# EAGLE board 40x24 (EAGLE 6.2), part 1 of 3
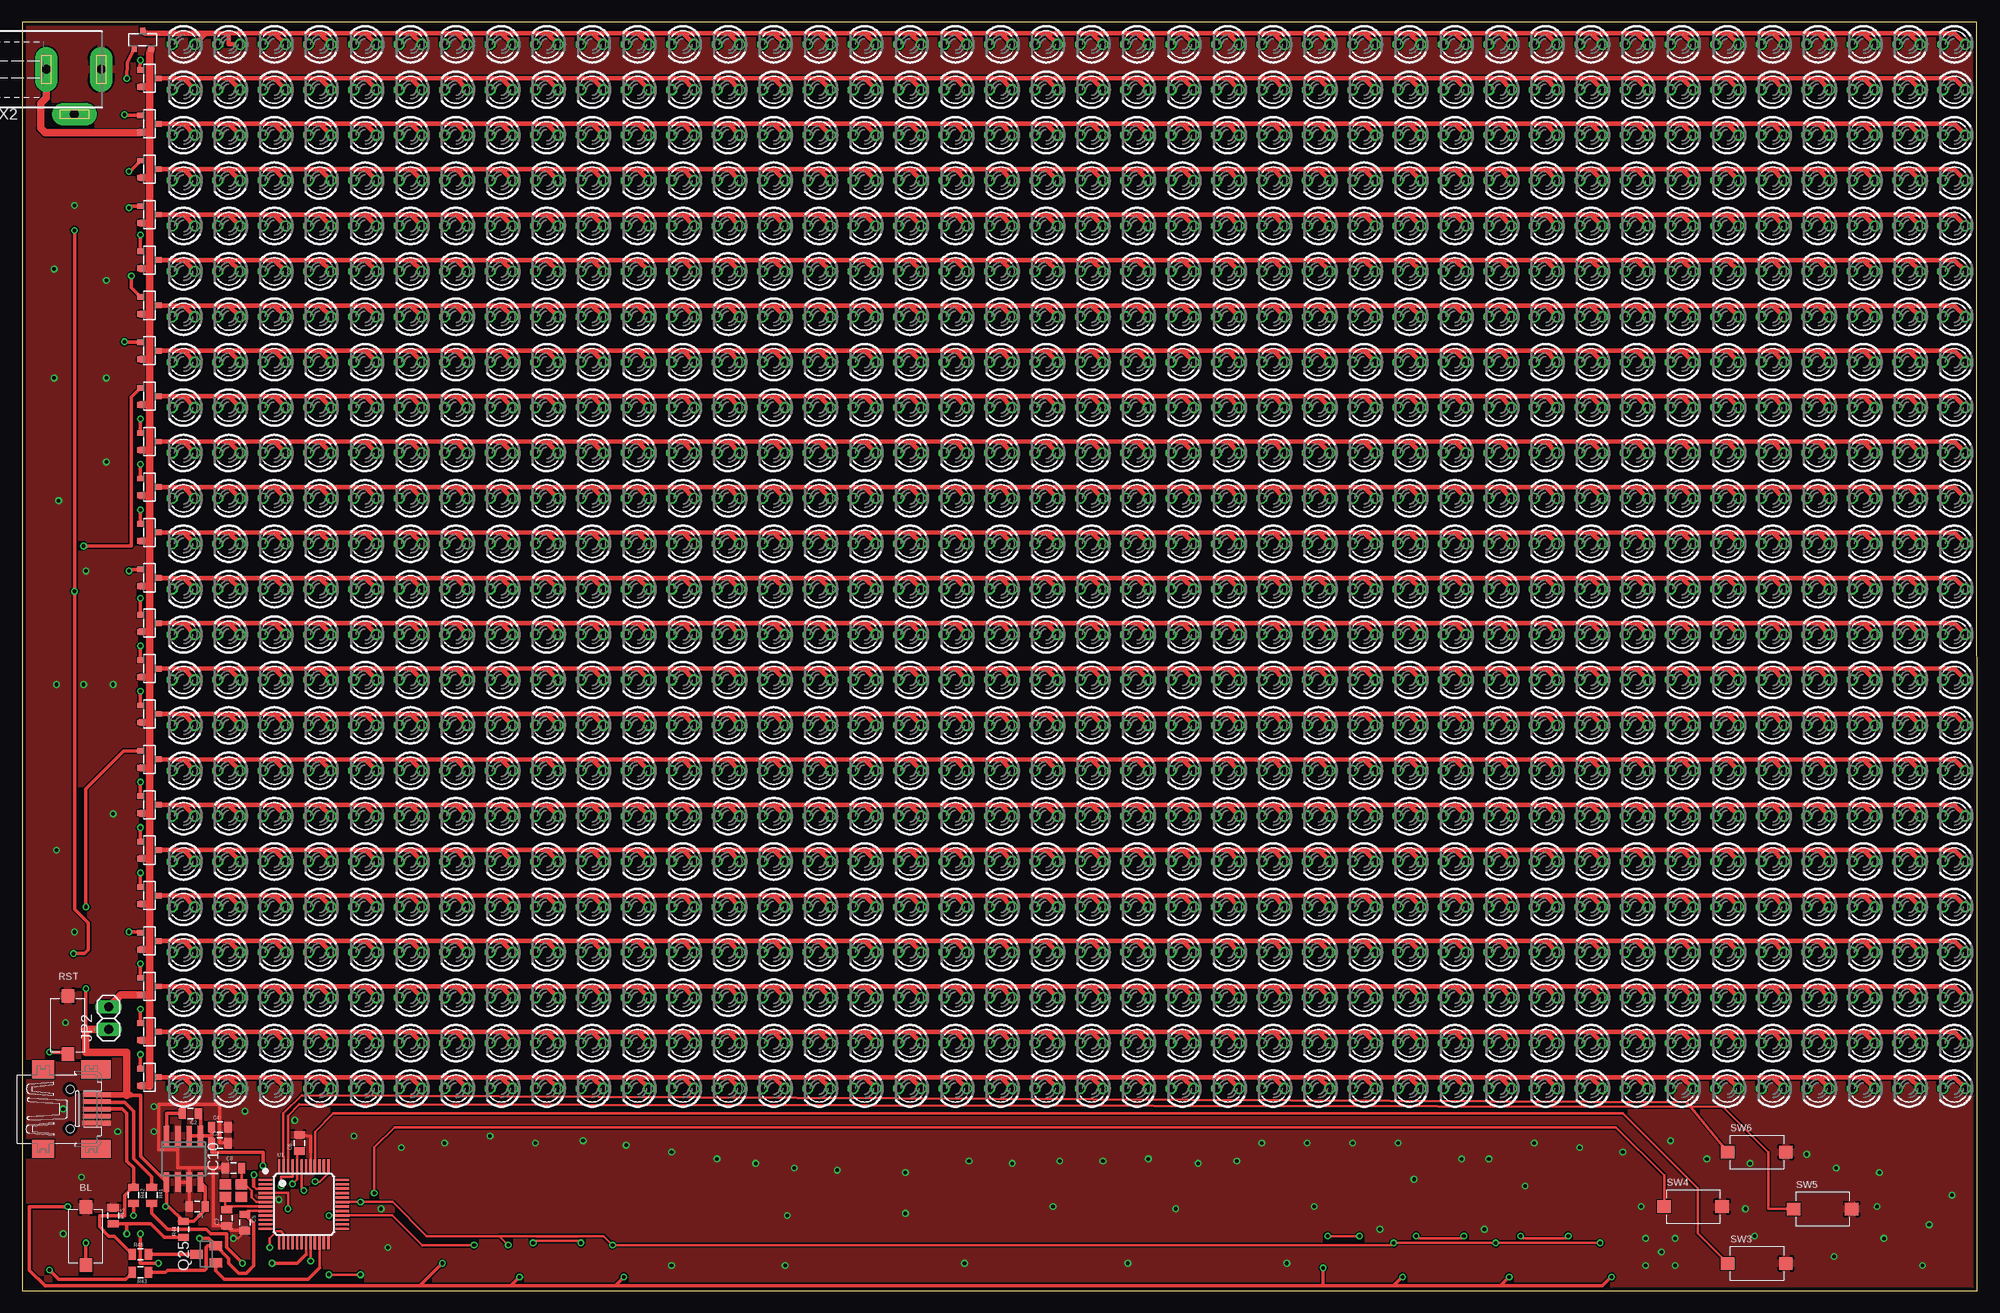
[diagram p4: board, top side]
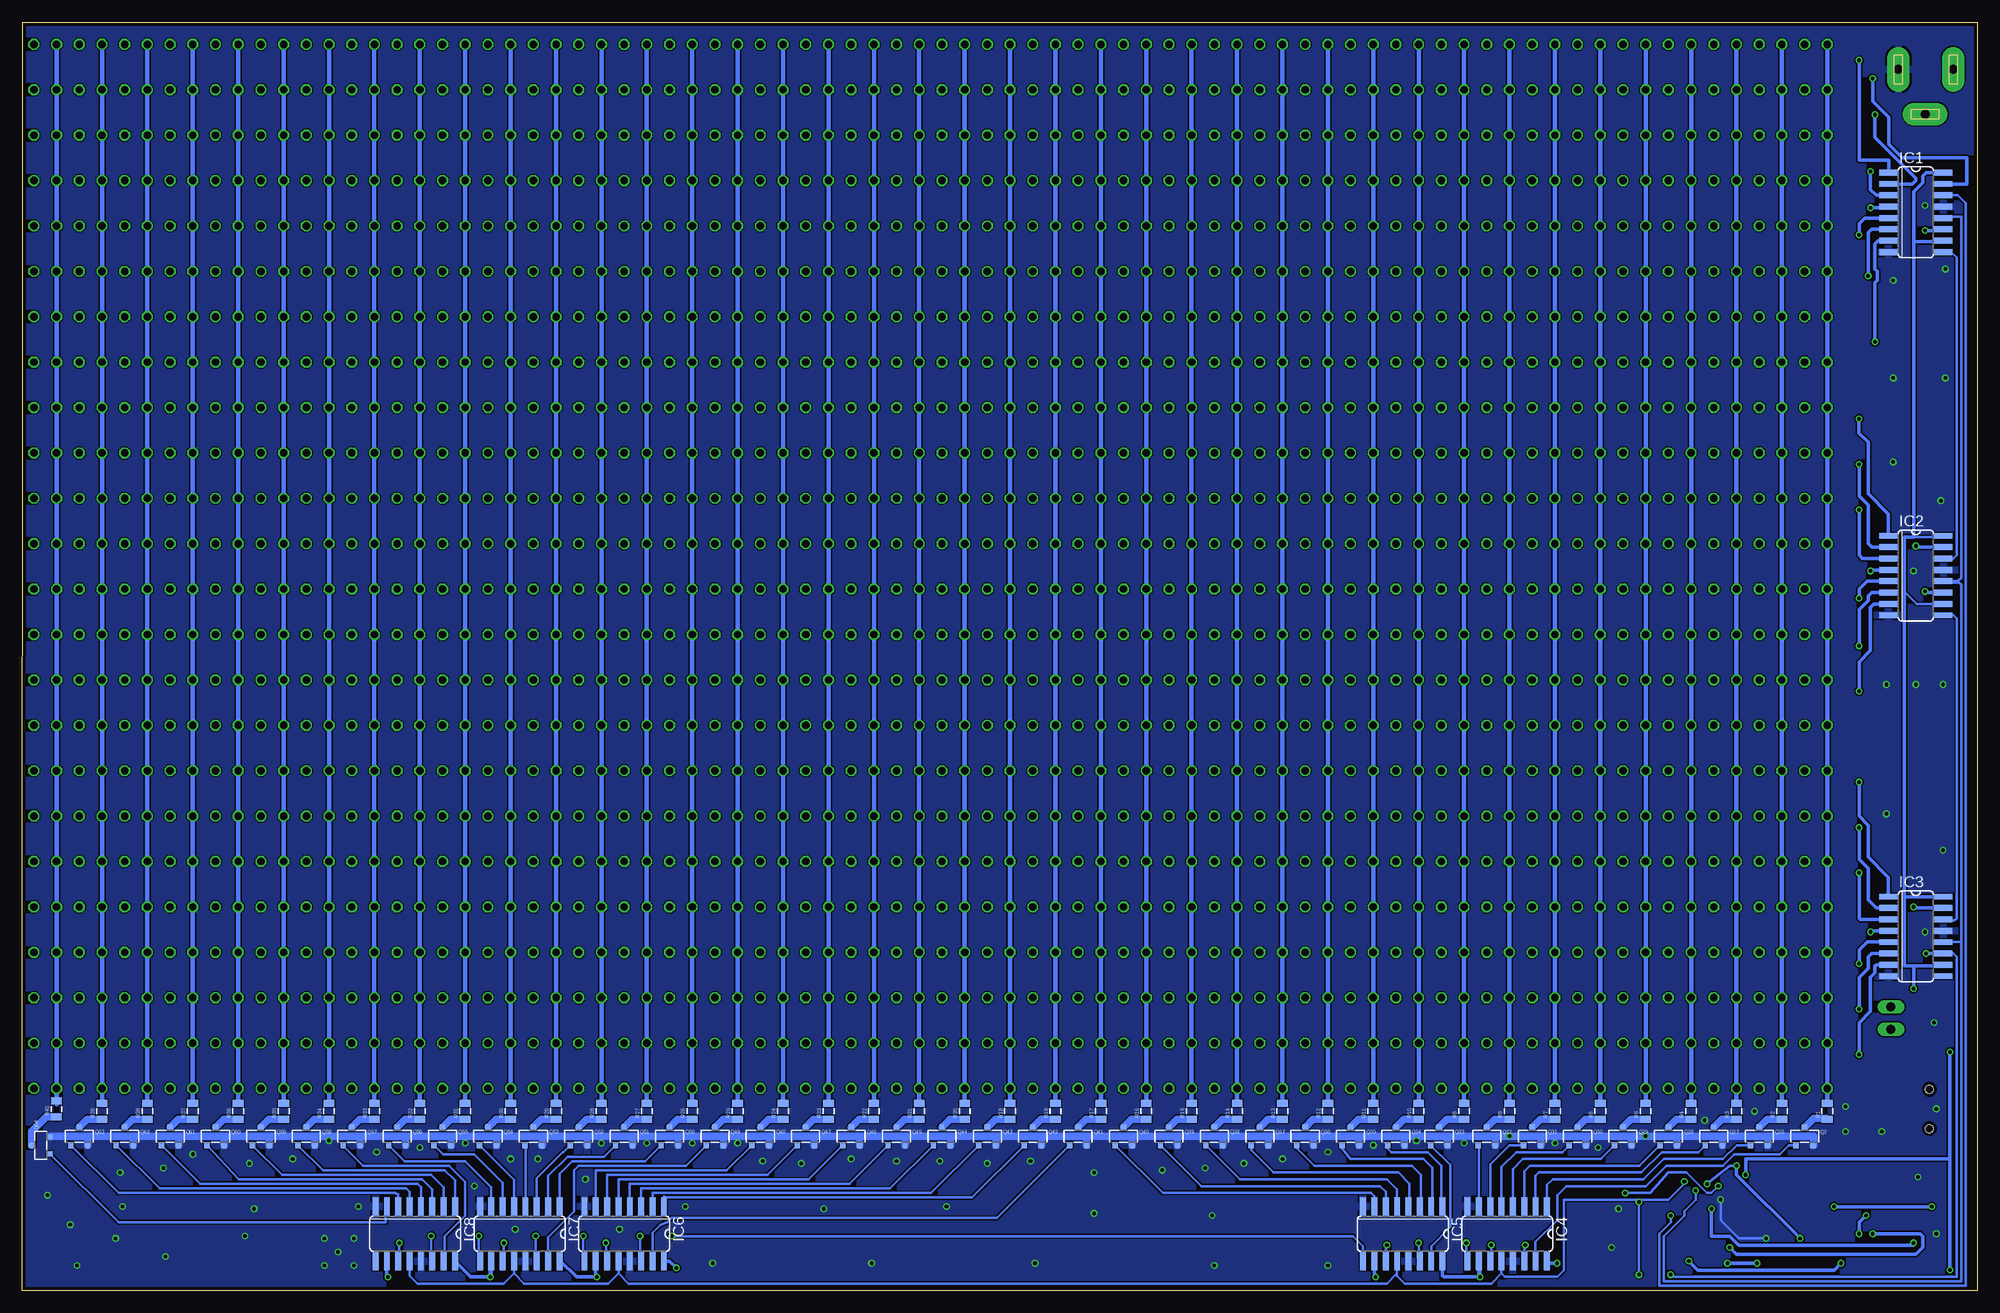
[diagram p5: board, bottom side, seen from below]

Size 218.71 x 141.91 mm. Coordinates in mm from the lower left corner, seen from the top.
Outline: 0,0 218.71,0 218.67,141.91 0,141.91 0,0
Copper layers (1*16): Top 0.0356mm / dielectric 1.5011mm / Bottom 0.0356mm
Design rules: minimum track width 6mil, minimum drill 13mil, track to track 6mil, track to pad 6mil, pad to pad 6mil, via to via 6mil, smd to smd 6mil, copper to edge 15mil, drill to drill 6mil, minimum pad ring 7mil, minimum via ring 7mil, stop-mask expansion 4mil, vias tented up to drill 0mil, thermal gap 10mil

## Footprints (pad centres in the part's own frame; a part is rotated, then mirrored left to right if it is on the bottom)
SWITCH_MCTAEF = smd 1.5 x 1.4: 1 -3.25,0; 2 3.25,0
0805 = smd 0.8 x 1.2: 1 -0.9,0; 2 0.9,0
SO16 = smd 0.66 x 2.032: 1 -4.445,-3.073; 2 -3.175,-3.073; 3 -1.905,-3.073; 4 -0.635,-3.073; 5 0.635,-3.073; 6 1.905,-3.073; 7 3.175,-3.073; 8 4.445,-3.073; 9 4.445,3.073; 10 3.175,3.073; 11 1.905,3.073; 12 0.635,3.073; 13 -0.635,3.073; 14 -1.905,3.073; 15 -3.175,3.073; 16 -4.445,3.073
SOIC8 = smd 0.6 x 2.2: 1 -1.905,-2.6; 2 -0.635,-2.6; 3 0.635,-2.6; 4 1.905,-2.6; 5 1.905,2.6; 6 0.635,2.6; 7 -0.635,2.6; 8 -1.905,2.6
1X02 = drill 1.016 long: 1 -1.27,0; 2 1.27,0
X22 = smd 1.3 x 1.1: 1 0.9,0.7; 2 -0.9,0.7; 3 -0.9,-0.7; 4 0.9,-0.7
LED3MM = drill 0.813 octagon: A -1.27,0; K 1.27,0
SOT23-R = smd 0.6 x 0.7: 1 -0.95,-1; 2 0.95,-1; 3 0,1
SOT23 = smd 1 x 1.4: 1 -0.95,-1.1; 2 0.95,-1.1; 3 0,1.1
LQFP48 = smd 1.5 x 0.25: 1 -4.3,2.75; 2 -4.3,2.25; 3 -4.3,1.75; 4 -4.3,1.25; 5 -4.3,0.75; 6 -4.3,0.25; 7 -4.3,-0.25; 8 -4.3,-0.75; 9 -4.3,-1.25; 10 -4.3,-1.75; 11 -4.3,-2.25; 12 -4.3,-2.75; 25 4.3,-2.75; 26 4.3,-2.25; 27 4.3,-1.75; 28 4.3,-1.25; 29 4.3,-0.75; 30 4.3,-0.25; 31 4.3,0.25; 32 4.3,0.75; 33 4.3,1.25; 34 4.3,1.75; 35 4.3,2.25; 36 4.3,2.75 | smd 0.25 x 1.5: 13 -2.75,-4.3; 14 -2.25,-4.3; 15 -1.75,-4.3; 16 -1.25,-4.3; 17 -0.75,-4.3; 18 -0.25,-4.3; 19 0.25,-4.3; 20 0.75,-4.3; 21 1.25,-4.3; 22 1.75,-4.3; 23 2.25,-4.3; 24 2.75,-4.3; 37 2.75,4.3; 38 2.25,4.3; 39 1.75,4.3; 40 1.25,4.3; 41 0.75,4.3; 42 0.25,4.3; 43 -0.25,4.3; 44 -0.75,4.3; 45 -1.25,4.3; 46 -1.75,4.3; 47 -2.25,4.3; 48 -2.75,4.3
32005-201 = smd 3.1 x 0.5: 1 3,1.6; 2 3,0.8; 3 3,0; 4 3,-0.8; 5 3,-1.6 | smd 2.5 x 2: M1 -3,-4.45; M2 -3,4.45 | smd 3.3 x 2: M3 2.9,4.45; M4 2.9,-4.45 | hole 0.9: 0,2.2; 0,-2.2
733980-62 = drill 1 pad 2.5 long: 1 0,8.57; 2 0,2.42; 3 5,5.57

## Placement (x,y rotation side)
BL  SWITCH_MCTAEF  [SWITCH_MCTAEF]  7.11,6.1 90 top
C1  [0805]  19.56,9.4 180 top
C2  [0805]  18.8,19.81 180 top
C3  [0805]  22.1,16.51 0 top
C4  [0805]  22.1,18.29 0 top
C5  100n  [0805]  24.89,7.62 270 top
C6  100n  [0805]  30.99,16.51 90 top
C7  22pF  [0805]  22.86,8.13 90 top
C8  22pF  [0805]  23.62,13.72 0 top
IC1  74HC595D  [SO16]  6.86,120.65 270 bottom
IC2  74HC595D  [SO16]  6.86,80.01 270 bottom
IC3  74HC595D  [SO16]  6.86,39.62 270 bottom
IC4  74HC595D  [SO16]  52.58,6.35 180 bottom
IC5  74HC595D  [SO16]  64.26,6.35 180 bottom
IC6  74HC595D  [SO16]  151.38,6.35 180 bottom
IC7  74HC595D  [SO16]  163.07,6.35 180 bottom
IC8  74HC595D  [SO16]  174.75,6.35 180 bottom
IC10  LT1763CS8-3.3  [SOIC8]  18.03,14.73 180 top
JP2  [1X02]  9.65,30.48 90 top
L1  12MHz  [X22]  23.62,11.18 0 top
LED1  [LED3MM]  18.03,139.45 180 top
LED2  [LED3MM]  23.11,139.45 180 top
LED3  [LED3MM]  28.19,139.45 180 top
LED4  [LED3MM]  33.27,139.45 180 top
LED5  [LED3MM]  38.35,139.45 180 top
LED6  [LED3MM]  43.43,139.45 180 top
LED7  [LED3MM]  48.51,139.45 180 top
LED8  [LED3MM]  53.59,139.45 180 top
LED9  [LED3MM]  58.67,139.45 180 top
LED10  [LED3MM]  63.75,139.45 180 top
LED11  [LED3MM]  68.83,139.45 180 top
LED12  [LED3MM]  73.91,139.45 180 top
LED13  [LED3MM]  78.99,139.45 180 top
LED14  [LED3MM]  84.07,139.45 180 top
LED15  [LED3MM]  89.15,139.45 180 top
LED16  [LED3MM]  94.23,139.45 180 top
LED17  [LED3MM]  99.31,139.45 180 top
LED18  [LED3MM]  104.39,139.45 180 top
LED19  [LED3MM]  109.47,139.45 180 top
LED20  [LED3MM]  114.55,139.45 180 top
LED21  [LED3MM]  119.63,139.45 180 top
LED22  [LED3MM]  124.71,139.45 180 top
LED23  [LED3MM]  129.79,139.45 180 top
LED24  [LED3MM]  134.87,139.45 180 top
LED25  [LED3MM]  139.95,139.45 180 top
LED26  [LED3MM]  145.03,139.45 180 top
LED27  [LED3MM]  150.11,139.45 180 top
LED28  [LED3MM]  155.19,139.45 180 top
LED29  [LED3MM]  160.27,139.45 180 top
LED30  [LED3MM]  165.35,139.45 180 top
LED31  [LED3MM]  170.43,139.45 180 top
LED32  [LED3MM]  175.51,139.45 180 top
LED33  [LED3MM]  180.59,139.45 180 top
LED34  [LED3MM]  185.67,139.45 180 top
LED35  [LED3MM]  190.75,139.45 180 top
LED36  [LED3MM]  195.83,139.45 180 top
LED37  [LED3MM]  200.91,139.45 180 top
LED38  [LED3MM]  205.99,139.45 180 top
LED39  [LED3MM]  211.07,139.45 180 top
LED40  [LED3MM]  216.15,139.45 180 top
LED41  [LED3MM]  18.03,134.37 180 top
LED42  [LED3MM]  23.11,134.37 180 top
LED43  [LED3MM]  28.19,134.37 180 top
LED44  [LED3MM]  33.27,134.37 180 top
LED45  [LED3MM]  38.35,134.37 180 top
LED46  [LED3MM]  43.43,134.37 180 top
LED47  [LED3MM]  48.51,134.37 180 top
LED48  [LED3MM]  53.59,134.37 180 top
LED49  [LED3MM]  58.67,134.37 180 top
LED50  [LED3MM]  63.75,134.37 180 top
LED51  [LED3MM]  68.83,134.37 180 top
LED52  [LED3MM]  73.91,134.37 180 top
LED53  [LED3MM]  78.99,134.37 180 top
LED54  [LED3MM]  84.07,134.37 180 top
LED55  [LED3MM]  89.15,134.37 180 top
LED56  [LED3MM]  94.23,134.37 180 top
LED57  [LED3MM]  99.31,134.37 180 top
LED58  [LED3MM]  104.39,134.37 180 top
LED59  [LED3MM]  109.47,134.37 180 top
LED60  [LED3MM]  114.55,134.37 180 top
LED61  [LED3MM]  119.63,134.37 180 top
LED62  [LED3MM]  124.71,134.37 180 top
LED63  [LED3MM]  129.79,134.37 180 top
LED64  [LED3MM]  134.87,134.37 180 top
LED65  [LED3MM]  139.95,134.37 180 top
LED66  [LED3MM]  145.03,134.37 180 top
LED67  [LED3MM]  150.11,134.37 180 top
LED68  [LED3MM]  155.19,134.37 180 top
LED69  [LED3MM]  160.27,134.37 180 top
LED70  [LED3MM]  165.35,134.37 180 top
LED71  [LED3MM]  170.43,134.37 180 top
LED72  [LED3MM]  175.51,134.37 180 top
LED73  [LED3MM]  180.59,134.37 180 top
LED74  [LED3MM]  185.67,134.37 180 top
LED75  [LED3MM]  190.75,134.37 180 top
LED76  [LED3MM]  195.83,134.37 180 top
LED77  [LED3MM]  200.91,134.37 180 top
LED78  [LED3MM]  205.99,134.37 180 top
LED79  [LED3MM]  211.07,134.37 180 top
LED80  [LED3MM]  216.15,134.37 180 top
LED81  [LED3MM]  18.03,129.29 180 top
LED82  [LED3MM]  23.11,129.29 180 top
LED83  [LED3MM]  28.19,129.29 180 top
LED84  [LED3MM]  33.27,129.29 180 top
LED85  [LED3MM]  38.35,129.29 180 top
LED86  [LED3MM]  43.43,129.29 180 top
LED87  [LED3MM]  48.51,129.29 180 top
LED88  [LED3MM]  53.59,129.29 180 top
LED89  [LED3MM]  58.67,129.29 180 top
LED90  [LED3MM]  63.75,129.29 180 top
LED91  [LED3MM]  68.83,129.29 180 top
LED92  [LED3MM]  73.91,129.29 180 top
LED93  [LED3MM]  78.99,129.29 180 top
LED94  [LED3MM]  84.07,129.29 180 top
LED95  [LED3MM]  89.15,129.29 180 top
LED96  [LED3MM]  94.23,129.29 180 top
LED97  [LED3MM]  99.31,129.29 180 top
LED98  [LED3MM]  104.39,129.29 180 top
LED99  [LED3MM]  109.47,129.29 180 top
LED100  [LED3MM]  114.55,129.29 180 top
LED101  [LED3MM]  119.63,129.29 180 top
LED102  [LED3MM]  124.71,129.29 180 top
LED103  [LED3MM]  129.79,129.29 180 top
LED104  [LED3MM]  134.87,129.29 180 top
LED105  [LED3MM]  139.95,129.29 180 top
LED106  [LED3MM]  145.03,129.29 180 top
LED107  [LED3MM]  150.11,129.29 180 top
LED108  [LED3MM]  155.19,129.29 180 top
LED109  [LED3MM]  160.27,129.29 180 top
LED110  [LED3MM]  165.35,129.29 180 top
LED111  [LED3MM]  170.43,129.29 180 top
LED112  [LED3MM]  175.51,129.29 180 top
LED113  [LED3MM]  180.59,129.29 180 top
LED114  [LED3MM]  185.67,129.29 180 top
LED115  [LED3MM]  190.75,129.29 180 top
LED116  [LED3MM]  195.83,129.29 180 top
LED117  [LED3MM]  200.91,129.29 180 top
LED118  [LED3MM]  205.99,129.29 180 top
LED119  [LED3MM]  211.07,129.29 180 top
LED120  [LED3MM]  216.15,129.29 180 top
LED121  [LED3MM]  18.03,124.21 180 top
LED122  [LED3MM]  23.11,124.21 180 top
LED123  [LED3MM]  28.19,124.21 180 top
LED124  [LED3MM]  33.27,124.21 180 top
LED125  [LED3MM]  38.35,124.21 180 top
LED126  [LED3MM]  43.43,124.21 180 top
LED127  [LED3MM]  48.51,124.21 180 top
LED128  [LED3MM]  53.59,124.21 180 top
LED129  [LED3MM]  58.67,124.21 180 top
LED130  [LED3MM]  63.75,124.21 180 top
LED131  [LED3MM]  68.83,124.21 180 top
LED132  [LED3MM]  73.91,124.21 180 top
LED133  [LED3MM]  78.99,124.21 180 top
LED134  [LED3MM]  84.07,124.21 180 top
LED135  [LED3MM]  89.15,124.21 180 top
LED136  [LED3MM]  94.23,124.21 180 top
LED137  [LED3MM]  99.31,124.21 180 top
LED138  [LED3MM]  104.39,124.21 180 top
LED139  [LED3MM]  109.47,124.21 180 top
LED140  [LED3MM]  114.55,124.21 180 top
LED141  [LED3MM]  119.63,124.21 180 top
LED142  [LED3MM]  124.71,124.21 180 top
LED143  [LED3MM]  129.79,124.21 180 top
LED144  [LED3MM]  134.87,124.21 180 top
LED145  [LED3MM]  139.95,124.21 180 top
LED146  [LED3MM]  145.03,124.21 180 top
LED147  [LED3MM]  150.11,124.21 180 top
LED148  [LED3MM]  155.19,124.21 180 top
LED149  [LED3MM]  160.27,124.21 180 top
LED150  [LED3MM]  165.35,124.21 180 top
LED151  [LED3MM]  170.43,124.21 180 top
LED152  [LED3MM]  175.51,124.21 180 top
LED153  [LED3MM]  180.59,124.21 180 top
LED154  [LED3MM]  185.67,124.21 180 top
LED155  [LED3MM]  190.75,124.21 180 top
LED156  [LED3MM]  195.83,124.21 180 top
LED157  [LED3MM]  200.91,124.21 180 top
LED158  [LED3MM]  205.99,124.21 180 top
LED159  [LED3MM]  211.07,124.21 180 top
LED160  [LED3MM]  216.15,124.21 180 top
LED161  [LED3MM]  18.03,119.13 180 top
LED162  [LED3MM]  23.11,119.13 180 top
LED163  [LED3MM]  28.19,119.13 180 top
LED164  [LED3MM]  33.27,119.13 180 top
LED165  [LED3MM]  38.35,119.13 180 top
LED166  [LED3MM]  43.43,119.13 180 top
LED167  [LED3MM]  48.51,119.13 180 top
LED168  [LED3MM]  53.59,119.13 180 top
LED169  [LED3MM]  58.67,119.13 180 top
LED170  [LED3MM]  63.75,119.13 180 top
LED171  [LED3MM]  68.83,119.13 180 top
LED172  [LED3MM]  73.91,119.13 180 top
LED173  [LED3MM]  78.99,119.13 180 top
LED174  [LED3MM]  84.07,119.13 180 top
LED175  [LED3MM]  89.15,119.13 180 top
LED176  [LED3MM]  94.23,119.13 180 top
LED177  [LED3MM]  99.31,119.13 180 top
LED178  [LED3MM]  104.39,119.13 180 top
LED179  [LED3MM]  109.47,119.13 180 top
LED180  [LED3MM]  114.55,119.13 180 top
LED181  [LED3MM]  119.63,119.13 180 top
LED182  [LED3MM]  124.71,119.13 180 top
LED183  [LED3MM]  129.79,119.13 180 top
LED184  [LED3MM]  134.87,119.13 180 top
LED185  [LED3MM]  139.95,119.13 180 top
LED186  [LED3MM]  145.03,119.13 180 top
LED187  [LED3MM]  150.11,119.13 180 top
LED188  [LED3MM]  155.19,119.13 180 top
LED189  [LED3MM]  160.27,119.13 180 top
LED190  [LED3MM]  165.35,119.13 180 top
LED191  [LED3MM]  170.43,119.13 180 top
LED192  [LED3MM]  175.51,119.13 180 top
LED193  [LED3MM]  180.59,119.13 180 top
LED194  [LED3MM]  185.67,119.13 180 top
LED195  [LED3MM]  190.75,119.13 180 top
LED196  [LED3MM]  195.83,119.13 180 top
LED197  [LED3MM]  200.91,119.13 180 top
LED198  [LED3MM]  205.99,119.13 180 top
LED199  [LED3MM]  211.07,119.13 180 top
LED200  [LED3MM]  216.15,119.13 180 top
LED201  [LED3MM]  18.03,114.05 180 top
LED202  [LED3MM]  23.11,114.05 180 top
LED203  [LED3MM]  28.19,114.05 180 top
LED204  [LED3MM]  33.27,114.05 180 top
LED205  [LED3MM]  38.35,114.05 180 top
LED206  [LED3MM]  43.43,114.05 180 top
LED207  [LED3MM]  48.51,114.05 180 top
LED208  [LED3MM]  53.59,114.05 180 top
LED209  [LED3MM]  58.67,114.05 180 top
LED210  [LED3MM]  63.75,114.05 180 top
LED211  [LED3MM]  68.83,114.05 180 top
LED212  [LED3MM]  73.91,114.05 180 top
LED213  [LED3MM]  78.99,114.05 180 top
LED214  [LED3MM]  84.07,114.05 180 top
LED215  [LED3MM]  89.15,114.05 180 top
LED216  [LED3MM]  94.23,114.05 180 top
LED217  [LED3MM]  99.31,114.05 180 top
LED218  [LED3MM]  104.39,114.05 180 top
LED219  [LED3MM]  109.47,114.05 180 top
LED220  [LED3MM]  114.55,114.05 180 top
LED221  [LED3MM]  119.63,114.05 180 top
LED222  [LED3MM]  124.71,114.05 180 top
LED223  [LED3MM]  129.79,114.05 180 top
LED224  [LED3MM]  134.87,114.05 180 top
LED225  [LED3MM]  139.95,114.05 180 top
LED226  [LED3MM]  145.03,114.05 180 top
LED227  [LED3MM]  150.11,114.05 180 top
LED228  [LED3MM]  155.19,114.05 180 top
LED229  [LED3MM]  160.27,114.05 180 top
LED230  [LED3MM]  165.35,114.05 180 top
LED231  [LED3MM]  170.43,114.05 180 top
LED232  [LED3MM]  175.51,114.05 180 top
LED233  [LED3MM]  180.59,114.05 180 top
LED234  [LED3MM]  185.67,114.05 180 top
LED235  [LED3MM]  190.75,114.05 180 top
LED236  [LED3MM]  195.83,114.05 180 top
LED237  [LED3MM]  200.91,114.05 180 top
LED238  [LED3MM]  205.99,114.05 180 top
LED239  [LED3MM]  211.07,114.05 180 top
LED240  [LED3MM]  216.15,114.05 180 top
LED241  [LED3MM]  18.03,108.97 180 top
LED242  [LED3MM]  23.11,108.97 180 top
LED243  [LED3MM]  28.19,108.97 180 top
LED244  [LED3MM]  33.27,108.97 180 top
LED245  [LED3MM]  38.35,108.97 180 top
LED246  [LED3MM]  43.43,108.97 180 top
LED247  [LED3MM]  48.51,108.97 180 top
LED248  [LED3MM]  53.59,108.97 180 top
LED249  [LED3MM]  58.67,108.97 180 top
LED250  [LED3MM]  63.75,108.97 180 top
LED251  [LED3MM]  68.83,108.97 180 top
LED252  [LED3MM]  73.91,108.97 180 top
LED253  [LED3MM]  78.99,108.97 180 top
LED254  [LED3MM]  84.07,108.97 180 top
LED255  [LED3MM]  89.15,108.97 180 top
LED256  [LED3MM]  94.23,108.97 180 top
LED257  [LED3MM]  99.31,108.97 180 top
LED258  [LED3MM]  104.39,108.97 180 top
LED259  [LED3MM]  109.47,108.97 180 top
LED260  [LED3MM]  114.55,108.97 180 top
LED261  [LED3MM]  119.63,108.97 180 top
LED262  [LED3MM]  124.71,108.97 180 top
LED263  [LED3MM]  129.79,108.97 180 top
LED264  [LED3MM]  134.87,108.97 180 top
LED265  [LED3MM]  139.95,108.97 180 top
LED266  [LED3MM]  145.03,108.97 180 top
LED267  [LED3MM]  150.11,108.97 180 top
LED268  [LED3MM]  155.19,108.97 180 top
LED269  [LED3MM]  160.27,108.97 180 top
LED270  [LED3MM]  165.35,108.97 180 top
LED271  [LED3MM]  170.43,108.97 180 top
LED272  [LED3MM]  175.51,108.97 180 top
LED273  [LED3MM]  180.59,108.97 180 top
LED274  [LED3MM]  185.67,108.97 180 top
LED275  [LED3MM]  190.75,108.97 180 top
LED276  [LED3MM]  195.83,108.97 180 top
LED277  [LED3MM]  200.91,108.97 180 top
LED278  [LED3MM]  205.99,108.97 180 top
LED279  [LED3MM]  211.07,108.97 180 top
LED280  [LED3MM]  216.15,108.97 180 top
LED281  [LED3MM]  18.03,103.89 180 top
LED282  [LED3MM]  23.11,103.89 180 top
LED283  [LED3MM]  28.19,103.89 180 top
LED284  [LED3MM]  33.27,103.89 180 top
LED285  [LED3MM]  38.35,103.89 180 top
LED286  [LED3MM]  43.43,103.89 180 top
LED287  [LED3MM]  48.51,103.89 180 top
LED288  [LED3MM]  53.59,103.89 180 top
LED289  [LED3MM]  58.67,103.89 180 top
LED290  [LED3MM]  63.75,103.89 180 top
LED291  [LED3MM]  68.83,103.89 180 top
LED292  [LED3MM]  73.91,103.89 180 top
LED293  [LED3MM]  78.99,103.89 180 top
LED294  [LED3MM]  84.07,103.89 180 top
LED295  [LED3MM]  89.15,103.89 180 top
LED296  [LED3MM]  94.23,103.89 180 top
LED297  [LED3MM]  99.31,103.89 180 top
LED298  [LED3MM]  104.39,103.89 180 top
LED299  [LED3MM]  109.47,103.89 180 top
LED300  [LED3MM]  114.55,103.89 180 top
LED301  [LED3MM]  119.63,103.89 180 top
LED302  [LED3MM]  124.71,103.89 180 top
LED303  [LED3MM]  129.79,103.89 180 top
LED304  [LED3MM]  134.87,103.89 180 top
LED305  [LED3MM]  139.95,103.89 180 top
LED306  [LED3MM]  145.03,103.89 180 top
LED307  [LED3MM]  150.11,103.89 180 top
LED308  [LED3MM]  155.19,103.89 180 top
LED309  [LED3MM]  160.27,103.89 180 top
LED310  [LED3MM]  165.35,103.89 180 top
LED311  [LED3MM]  170.43,103.89 180 top
LED312  [LED3MM]  175.51,103.89 180 top
LED313  [LED3MM]  180.59,103.89 180 top
LED314  [LED3MM]  185.67,103.89 180 top
LED315  [LED3MM]  190.75,103.89 180 top
LED316  [LED3MM]  195.83,103.89 180 top
LED317  [LED3MM]  200.91,103.89 180 top
LED318  [LED3MM]  205.99,103.89 180 top
LED319  [LED3MM]  211.07,103.89 180 top
LED320  [LED3MM]  216.15,103.89 180 top
LED321  [LED3MM]  18.03,98.81 180 top
LED322  [LED3MM]  23.11,98.81 180 top
LED323  [LED3MM]  28.19,98.81 180 top
LED324  [LED3MM]  33.27,98.81 180 top
LED325  [LED3MM]  38.35,98.81 180 top
LED326  [LED3MM]  43.43,98.81 180 top
LED327  [LED3MM]  48.51,98.81 180 top
LED328  [LED3MM]  53.59,98.81 180 top
LED329  [LED3MM]  58.67,98.81 180 top
LED330  [LED3MM]  63.75,98.81 180 top
LED331  [LED3MM]  68.83,98.81 180 top
LED332  [LED3MM]  73.91,98.81 180 top
LED333  [LED3MM]  78.99,98.81 180 top
LED334  [LED3MM]  84.07,98.81 180 top
LED335  [LED3MM]  89.15,98.81 180 top
LED336  [LED3MM]  94.23,98.81 180 top
LED337  [LED3MM]  99.31,98.81 180 top
LED338  [LED3MM]  104.39,98.81 180 top
LED339  [LED3MM]  109.47,98.81 180 top
LED340  [LED3MM]  114.55,98.81 180 top
LED341  [LED3MM]  119.63,98.81 180 top
LED342  [LED3MM]  124.71,98.81 180 top
LED343  [LED3MM]  129.79,98.81 180 top
LED344  [LED3MM]  134.87,98.81 180 top
LED345  [LED3MM]  139.95,98.81 180 top
LED346  [LED3MM]  145.03,98.81 180 top
LED347  [LED3MM]  150.11,98.81 180 top
LED348  [LED3MM]  155.19,98.81 180 top
LED349  [LED3MM]  160.27,98.81 180 top
LED350  [LED3MM]  165.35,98.81 180 top
LED351  [LED3MM]  170.43,98.81 180 top
LED352  [LED3MM]  175.51,98.81 180 top
LED353  [LED3MM]  180.59,98.81 180 top
LED354  [LED3MM]  185.67,98.81 180 top
LED355  [LED3MM]  190.75,98.81 180 top
LED356  [LED3MM]  195.83,98.81 180 top
LED357  [LED3MM]  200.91,98.81 180 top
LED358  [LED3MM]  205.99,98.81 180 top
LED359  [LED3MM]  211.07,98.81 180 top
LED360  [LED3MM]  216.15,98.81 180 top
LED361  [LED3MM]  18.03,93.73 180 top
LED362  [LED3MM]  23.11,93.73 180 top
LED363  [LED3MM]  28.19,93.73 180 top
LED364  [LED3MM]  33.27,93.73 180 top
LED365  [LED3MM]  38.35,93.73 180 top
LED366  [LED3MM]  43.43,93.73 180 top
LED367  [LED3MM]  48.51,93.73 180 top
LED368  [LED3MM]  53.59,93.73 180 top
LED369  [LED3MM]  58.67,93.73 180 top
LED370  [LED3MM]  63.75,93.73 180 top
LED371  [LED3MM]  68.83,93.73 180 top
LED372  [LED3MM]  73.91,93.73 180 top
LED373  [LED3MM]  78.99,93.73 180 top
LED374  [LED3MM]  84.07,93.73 180 top
LED375  [LED3MM]  89.15,93.73 180 top
LED376  [LED3MM]  94.23,93.73 180 top
LED377  [LED3MM]  99.31,93.73 180 top
LED378  [LED3MM]  104.39,93.73 180 top
LED379  [LED3MM]  109.47,93.73 180 top
LED380  [LED3MM]  114.55,93.73 180 top
LED381  [LED3MM]  119.63,93.73 180 top
LED382  [LED3MM]  124.71,93.73 180 top
LED383  [LED3MM]  129.79,93.73 180 top
LED384  [LED3MM]  134.87,93.73 180 top
LED385  [LED3MM]  139.95,93.73 180 top
LED386  [LED3MM]  145.03,93.73 180 top
LED387  [LED3MM]  150.11,93.73 180 top
LED388  [LED3MM]  155.19,93.73 180 top
LED389  [LED3MM]  160.27,93.73 180 top
LED390  [LED3MM]  165.35,93.73 180 top
LED391  [LED3MM]  170.43,93.73 180 top
LED392  [LED3MM]  175.51,93.73 180 top
LED393  [LED3MM]  180.59,93.73 180 top
LED394  [LED3MM]  185.67,93.73 180 top
LED395  [LED3MM]  190.75,93.73 180 top
LED396  [LED3MM]  195.83,93.73 180 top
LED397  [LED3MM]  200.91,93.73 180 top
LED398  [LED3MM]  205.99,93.73 180 top
LED399  [LED3MM]  211.07,93.73 180 top
LED400  [LED3MM]  216.15,93.73 180 top
LED401  [LED3MM]  18.03,88.65 180 top
LED402  [LED3MM]  23.11,88.65 180 top
LED403  [LED3MM]  28.19,88.65 180 top
LED404  [LED3MM]  33.27,88.65 180 top
LED405  [LED3MM]  38.35,88.65 180 top
LED406  [LED3MM]  43.43,88.65 180 top
LED407  [LED3MM]  48.51,88.65 180 top
LED408  [LED3MM]  53.59,88.65 180 top
LED409  [LED3MM]  58.67,88.65 180 top
LED410  [LED3MM]  63.75,88.65 180 top
LED411  [LED3MM]  68.83,88.65 180 top
LED412  [LED3MM]  73.91,88.65 180 top
LED413  [LED3MM]  78.99,88.65 180 top
LED414  [LED3MM]  84.07,88.65 180 top
LED415  [LED3MM]  89.15,88.65 180 top
LED416  [LED3MM]  94.23,88.65 180 top
LED417  [LED3MM]  99.31,88.65 180 top
LED418  [LED3MM]  104.39,88.65 180 top
LED419  [LED3MM]  109.47,88.65 180 top
LED420  [LED3MM]  114.55,88.65 180 top
LED421  [LED3MM]  119.63,88.65 180 top
LED422  [LED3MM]  124.71,88.65 180 top
LED423  [LED3MM]  129.79,88.65 180 top
LED424  [LED3MM]  134.87,88.65 180 top
LED425  [LED3MM]  139.95,88.65 180 top
LED426  [LED3MM]  145.03,88.65 180 top
LED427  [LED3MM]  150.11,88.65 180 top
LED428  [LED3MM]  155.19,88.65 180 top
LED429  [LED3MM]  160.27,88.65 180 top
LED430  [LED3MM]  165.35,88.65 180 top
LED431  [LED3MM]  170.43,88.65 180 top
LED432  [LED3MM]  175.51,88.65 180 top
LED433  [LED3MM]  180.59,88.65 180 top
LED434  [LED3MM]  185.67,88.65 180 top
LED435  [LED3MM]  190.75,88.65 180 top
LED436  [LED3MM]  195.83,88.65 180 top
LED437  [LED3MM]  200.91,88.65 180 top
LED438  [LED3MM]  205.99,88.65 180 top
LED439  [LED3MM]  211.07,88.65 180 top
LED440  [LED3MM]  216.15,88.65 180 top
LED441  [LED3MM]  18.03,83.57 180 top
LED442  [LED3MM]  23.11,83.57 180 top
LED443  [LED3MM]  28.19,83.57 180 top
LED444  [LED3MM]  33.27,83.57 180 top
LED445  [LED3MM]  38.35,83.57 180 top
LED446  [LED3MM]  43.43,83.57 180 top
LED447  [LED3MM]  48.51,83.57 180 top
LED448  [LED3MM]  53.59,83.57 180 top
LED449  [LED3MM]  58.67,83.57 180 top
LED450  [LED3MM]  63.75,83.57 180 top
LED451  [LED3MM]  68.83,83.57 180 top
LED452  [LED3MM]  73.91,83.57 180 top
LED453  [LED3MM]  78.99,83.57 180 top
LED454  [LED3MM]  84.07,83.57 180 top
LED455  [LED3MM]  89.15,83.57 180 top
LED456  [LED3MM]  94.23,83.57 180 top
LED457  [LED3MM]  99.31,83.57 180 top
LED458  [LED3MM]  104.39,83.57 180 top
LED459  [LED3MM]  109.47,83.57 180 top
LED460  [LED3MM]  114.55,83.57 180 top
LED461  [LED3MM]  119.63,83.57 180 top
LED462  [LED3MM]  124.71,83.57 180 top
LED463  [LED3MM]  129.79,83.57 180 top
LED464  [LED3MM]  134.87,83.57 180 top
LED465  [LED3MM]  139.95,83.57 180 top
LED466  [LED3MM]  145.03,83.57 180 top
LED467  [LED3MM]  150.11,83.57 180 top
LED468  [LED3MM]  155.19,83.57 180 top
LED469  [LED3MM]  160.27,83.57 180 top
LED470  [LED3MM]  165.35,83.57 180 top
LED471  [LED3MM]  170.43,83.57 180 top
LED472  [LED3MM]  175.51,83.57 180 top
LED473  [LED3MM]  180.59,83.57 180 top
LED474  [LED3MM]  185.67,83.57 180 top
LED475  [LED3MM]  190.75,83.57 180 top
LED476  [LED3MM]  195.83,83.57 180 top
LED477  [LED3MM]  200.91,83.57 180 top
LED478  [LED3MM]  205.99,83.57 180 top
LED479  [LED3MM]  211.07,83.57 180 top
LED480  [LED3MM]  216.15,83.57 180 top
LED481  [LED3MM]  18.03,78.49 180 top
LED482  [LED3MM]  23.11,78.49 180 top
LED483  [LED3MM]  28.19,78.49 180 top
LED484  [LED3MM]  33.27,78.49 180 top
LED485  [LED3MM]  38.35,78.49 180 top
LED486  [LED3MM]  43.43,78.49 180 top
LED487  [LED3MM]  48.51,78.49 180 top
LED488  [LED3MM]  53.59,78.49 180 top
LED489  [LED3MM]  58.67,78.49 180 top
LED490  [LED3MM]  63.75,78.49 180 top
LED491  [LED3MM]  68.83,78.49 180 top
LED492  [LED3MM]  73.91,78.49 180 top
LED493  [LED3MM]  78.99,78.49 180 top
LED494  [LED3MM]  84.07,78.49 180 top
LED495  [LED3MM]  89.15,78.49 180 top
LED496  [LED3MM]  94.23,78.49 180 top
LED497  [LED3MM]  99.31,78.49 180 top
LED498  [LED3MM]  104.39,78.49 180 top
LED499  [LED3MM]  109.47,78.49 180 top
LED500  [LED3MM]  114.55,78.49 180 top
LED501  [LED3MM]  119.63,78.49 180 top
LED502  [LED3MM]  124.71,78.49 180 top
LED503  [LED3MM]  129.79,78.49 180 top
LED504  [LED3MM]  134.87,78.49 180 top
LED505  [LED3MM]  139.95,78.49 180 top
LED506  [LED3MM]  145.03,78.49 180 top
LED507  [LED3MM]  150.11,78.49 180 top
LED508  [LED3MM]  155.19,78.49 180 top
LED509  [LED3MM]  160.27,78.49 180 top
LED510  [LED3MM]  165.35,78.49 180 top
LED511  [LED3MM]  170.43,78.49 180 top
LED512  [LED3MM]  175.51,78.49 180 top
LED513  [LED3MM]  180.59,78.49 180 top
LED514  [LED3MM]  185.67,78.49 180 top
LED515  [LED3MM]  190.75,78.49 180 top
LED516  [LED3MM]  195.83,78.49 180 top
LED517  [LED3MM]  200.91,78.49 180 top
LED518  [LED3MM]  205.99,78.49 180 top
LED519  [LED3MM]  211.07,78.49 180 top
LED520  [LED3MM]  216.15,78.49 180 top
LED521  [LED3MM]  18.03,73.41 180 top
LED522  [LED3MM]  23.11,73.41 180 top
LED523  [LED3MM]  28.19,73.41 180 top
LED524  [LED3MM]  33.27,73.41 180 top
LED525  [LED3MM]  38.35,73.41 180 top
LED526  [LED3MM]  43.43,73.41 180 top
LED527  [LED3MM]  48.51,73.41 180 top
LED528  [LED3MM]  53.59,73.41 180 top
LED529  [LED3MM]  58.67,73.41 180 top
LED530  [LED3MM]  63.75,73.41 180 top
LED531  [LED3MM]  68.83,73.41 180 top
LED532  [LED3MM]  73.91,73.41 180 top
LED533  [LED3MM]  78.99,73.41 180 top
LED534  [LED3MM]  84.07,73.41 180 top
LED535  [LED3MM]  89.15,73.41 180 top
LED536  [LED3MM]  94.23,73.41 180 top
LED537  [LED3MM]  99.31,73.41 180 top
LED538  [LED3MM]  104.39,73.41 180 top
LED539  [LED3MM]  109.47,73.41 180 top
LED540  [LED3MM]  114.55,73.41 180 top
LED541  [LED3MM]  119.63,73.41 180 top
LED542  [LED3MM]  124.71,73.41 180 top
LED543  [LED3MM]  129.79,73.41 180 top
LED544  [LED3MM]  134.87,73.41 180 top
LED545  [LED3MM]  139.95,73.41 180 top
LED546  [LED3MM]  145.03,73.41 180 top
LED547  [LED3MM]  150.11,73.41 180 top
LED548  [LED3MM]  155.19,73.41 180 top
LED549  [LED3MM]  160.27,73.41 180 top
LED550  [LED3MM]  165.35,73.41 180 top
LED551  [LED3MM]  170.43,73.41 180 top
LED552  [LED3MM]  175.51,73.41 180 top
LED553  [LED3MM]  180.59,73.41 180 top
LED554  [LED3MM]  185.67,73.41 180 top
LED555  [LED3MM]  190.75,73.41 180 top
LED556  [LED3MM]  195.83,73.41 180 top
LED557  [LED3MM]  200.91,73.41 180 top
LED558  [LED3MM]  205.99,73.41 180 top
LED559  [LED3MM]  211.07,73.41 180 top
LED560  [LED3MM]  216.15,73.41 180 top
LED561  [LED3MM]  18.03,68.33 180 top
LED562  [LED3MM]  23.11,68.33 180 top
LED563  [LED3MM]  28.19,68.33 180 top
LED564  [LED3MM]  33.27,68.33 180 top
LED565  [LED3MM]  38.35,68.33 180 top
LED566  [LED3MM]  43.43,68.33 180 top
LED567  [LED3MM]  48.51,68.33 180 top
LED568  [LED3MM]  53.59,68.33 180 top
LED569  [LED3MM]  58.67,68.33 180 top
LED570  [LED3MM]  63.75,68.33 180 top
LED571  [LED3MM]  68.83,68.33 180 top
LED572  [LED3MM]  73.91,68.33 180 top
LED573  [LED3MM]  78.99,68.33 180 top
LED574  [LED3MM]  84.07,68.33 180 top
LED575  [LED3MM]  89.15,68.33 180 top
LED576  [LED3MM]  94.23,68.33 180 top
LED577  [LED3MM]  99.31,68.33 180 top
LED578  [LED3MM]  104.39,68.33 180 top
LED579  [LED3MM]  109.47,68.33 180 top
LED580  [LED3MM]  114.55,68.33 180 top
LED581  [LED3MM]  119.63,68.33 180 top
LED582  [LED3MM]  124.71,68.33 180 top
LED583  [LED3MM]  129.79,68.33 180 top
LED584  [LED3MM]  134.87,68.33 180 top
LED585  [LED3MM]  139.95,68.33 180 top
LED586  [LED3MM]  145.03,68.33 180 top
LED587  [LED3MM]  150.11,68.33 180 top
LED588  [LED3MM]  155.19,68.33 180 top
LED589  [LED3MM]  160.27,68.33 180 top
LED590  [LED3MM]  165.35,68.33 180 top
LED591  [LED3MM]  170.43,68.33 180 top
LED592  [LED3MM]  175.51,68.33 180 top
LED593  [LED3MM]  180.59,68.33 180 top
LED594  [LED3MM]  185.67,68.33 180 top
LED595  [LED3MM]  190.75,68.33 180 top
LED596  [LED3MM]  195.83,68.33 180 top
LED597  [LED3MM]  200.91,68.33 180 top
LED598  [LED3MM]  205.99,68.33 180 top
LED599  [LED3MM]  211.07,68.33 180 top
LED600  [LED3MM]  216.15,68.33 180 top
LED601  [LED3MM]  18.03,63.25 180 top
LED602  [LED3MM]  23.11,63.25 180 top
LED603  [LED3MM]  28.19,63.25 180 top
LED604  [LED3MM]  33.27,63.25 180 top
LED605  [LED3MM]  38.35,63.25 180 top
LED606  [LED3MM]  43.43,63.25 180 top
LED607  [LED3MM]  48.51,63.25 180 top
LED608  [LED3MM]  53.59,63.25 180 top
LED609  [LED3MM]  58.67,63.25 180 top
LED610  [LED3MM]  63.75,63.25 180 top
LED611  [LED3MM]  68.83,63.25 180 top
LED612  [LED3MM]  73.91,63.25 180 top
LED613  [LED3MM]  78.99,63.25 180 top
LED614  [LED3MM]  84.07,63.25 180 top
LED615  [LED3MM]  89.15,63.25 180 top
LED616  [LED3MM]  94.23,63.25 180 top
LED617  [LED3MM]  99.31,63.25 180 top
LED618  [LED3MM]  104.39,63.25 180 top
LED619  [LED3MM]  109.47,63.25 180 top
LED620  [LED3MM]  114.55,63.25 180 top
LED621  [LED3MM]  119.63,63.25 180 top
LED622  [LED3MM]  124.71,63.25 180 top
LED623  [LED3MM]  129.79,63.25 180 top
LED624  [LED3MM]  134.87,63.25 180 top
LED625  [LED3MM]  139.95,63.25 180 top
LED626  [LED3MM]  145.03,63.25 180 top
LED627  [LED3MM]  150.11,63.25 180 top
LED628  [LED3MM]  155.19,63.25 180 top
LED629  [LED3MM]  160.27,63.25 180 top
LED630  [LED3MM]  165.35,63.25 180 top
LED631  [LED3MM]  170.43,63.25 180 top
LED632  [LED3MM]  175.51,63.25 180 top
LED633  [LED3MM]  180.59,63.25 180 top
LED634  [LED3MM]  185.67,63.25 180 top
LED635  [LED3MM]  190.75,63.25 180 top
LED636  [LED3MM]  195.83,63.25 180 top
LED637  [LED3MM]  200.91,63.25 180 top
LED638  [LED3MM]  205.99,63.25 180 top
LED639  [LED3MM]  211.07,63.25 180 top
LED640  [LED3MM]  216.15,63.25 180 top
LED641  [LED3MM]  18.03,58.17 180 top
LED642  [LED3MM]  23.11,58.17 180 top
LED643  [LED3MM]  28.19,58.17 180 top
LED644  [LED3MM]  33.27,58.17 180 top
LED645  [LED3MM]  38.35,58.17 180 top
LED646  [LED3MM]  43.43,58.17 180 top
LED647  [LED3MM]  48.51,58.17 180 top
LED648  [LED3MM]  53.59,58.17 180 top
LED649  [LED3MM]  58.67,58.17 180 top
LED650  [LED3MM]  63.75,58.17 180 top
LED651  [LED3MM]  68.83,58.17 180 top
LED652  [LED3MM]  73.91,58.17 180 top
LED653  [LED3MM]  78.99,58.17 180 top
LED654  [LED3MM]  84.07,58.17 180 top
LED655  [LED3MM]  89.15,58.17 180 top
LED656  [LED3MM]  94.23,58.17 180 top
LED657  [LED3MM]  99.31,58.17 180 top
LED658  [LED3MM]  104.39,58.17 180 top
LED659  [LED3MM]  109.47,58.17 180 top
LED660  [LED3MM]  114.55,58.17 180 top
LED661  [LED3MM]  119.63,58.17 180 top
LED662  [LED3MM]  124.71,58.17 180 top
LED663  [LED3MM]  129.79,58.17 180 top
LED664  [LED3MM]  134.87,58.17 180 top
LED665  [LED3MM]  139.95,58.17 180 top
LED666  [LED3MM]  145.03,58.17 180 top
LED667  [LED3MM]  150.11,58.17 180 top
LED668  [LED3MM]  155.19,58.17 180 top
LED669  [LED3MM]  160.27,58.17 180 top
LED670  [LED3MM]  165.35,58.17 180 top
LED671  [LED3MM]  170.43,58.17 180 top
LED672  [LED3MM]  175.51,58.17 180 top
LED673  [LED3MM]  180.59,58.17 180 top
LED674  [LED3MM]  185.67,58.17 180 top
LED675  [LED3MM]  190.75,58.17 180 top
LED676  [LED3MM]  195.83,58.17 180 top
LED677  [LED3MM]  200.91,58.17 180 top
LED678  [LED3MM]  205.99,58.17 180 top
LED679  [LED3MM]  211.07,58.17 180 top
LED680  [LED3MM]  216.15,58.17 180 top
LED681  [LED3MM]  18.03,53.09 180 top
LED682  [LED3MM]  23.11,53.09 180 top
LED683  [LED3MM]  28.19,53.09 180 top
LED684  [LED3MM]  33.27,53.09 180 top
LED685  [LED3MM]  38.35,53.09 180 top
LED686  [LED3MM]  43.43,53.09 180 top
LED687  [LED3MM]  48.51,53.09 180 top
LED688  [LED3MM]  53.59,53.09 180 top
LED689  [LED3MM]  58.67,53.09 180 top
LED690  [LED3MM]  63.75,53.09 180 top
LED691  [LED3MM]  68.83,53.09 180 top
LED692  [LED3MM]  73.91,53.09 180 top
LED693  [LED3MM]  78.99,53.09 180 top
LED694  [LED3MM]  84.07,53.09 180 top
LED695  [LED3MM]  89.15,53.09 180 top
LED696  [LED3MM]  94.23,53.09 180 top
LED697  [LED3MM]  99.31,53.09 180 top
LED698  [LED3MM]  104.39,53.09 180 top
LED699  [LED3MM]  109.47,53.09 180 top
LED700  [LED3MM]  114.55,53.09 180 top
LED701  [LED3MM]  119.63,53.09 180 top
LED702  [LED3MM]  124.71,53.09 180 top
LED703  [LED3MM]  129.79,53.09 180 top
LED704  [LED3MM]  134.87,53.09 180 top
LED705  [LED3MM]  139.95,53.09 180 top
LED706  [LED3MM]  145.03,53.09 180 top
LED707  [LED3MM]  150.11,53.09 180 top
LED708  [LED3MM]  155.19,53.09 180 top
LED709  [LED3MM]  160.27,53.09 180 top
LED710  [LED3MM]  165.35,53.09 180 top
LED711  [LED3MM]  170.43,53.09 180 top
LED712  [LED3MM]  175.51,53.09 180 top
LED713  [LED3MM]  180.59,53.09 180 top
LED714  [LED3MM]  185.67,53.09 180 top
LED715  [LED3MM]  190.75,53.09 180 top
LED716  [LED3MM]  195.83,53.09 180 top
LED717  [LED3MM]  200.91,53.09 180 top
LED718  [LED3MM]  205.99,53.09 180 top
LED719  [LED3MM]  211.07,53.09 180 top
LED720  [LED3MM]  216.15,53.09 180 top
LED721  [LED3MM]  18.03,48.01 180 top
LED722  [LED3MM]  23.11,48.01 180 top
LED723  [LED3MM]  28.19,48.01 180 top
LED724  [LED3MM]  33.27,48.01 180 top
LED725  [LED3MM]  38.35,48.01 180 top
LED726  [LED3MM]  43.43,48.01 180 top
LED727  [LED3MM]  48.51,48.01 180 top
LED728  [LED3MM]  53.59,48.01 180 top
LED729  [LED3MM]  58.67,48.01 180 top
LED730  [LED3MM]  63.75,48.01 180 top
LED731  [LED3MM]  68.83,48.01 180 top
LED732  [LED3MM]  73.91,48.01 180 top
LED733  [LED3MM]  78.99,48.01 180 top
LED734  [LED3MM]  84.07,48.01 180 top
LED735  [LED3MM]  89.15,48.01 180 top
LED736  [LED3MM]  94.23,48.01 180 top
LED737  [LED3MM]  99.31,48.01 180 top
LED738  [LED3MM]  104.39,48.01 180 top
LED739  [LED3MM]  109.47,48.01 180 top
LED740  [LED3MM]  114.55,48.01 180 top
LED741  [LED3MM]  119.63,48.01 180 top
LED742  [LED3MM]  124.71,48.01 180 top
LED743  [LED3MM]  129.79,48.01 180 top
LED744  [LED3MM]  134.87,48.01 180 top
LED745  [LED3MM]  139.95,48.01 180 top
LED746  [LED3MM]  145.03,48.01 180 top
LED747  [LED3MM]  150.11,48.01 180 top
LED748  [LED3MM]  155.19,48.01 180 top
LED749  [LED3MM]  160.27,48.01 180 top
LED750  [LED3MM]  165.35,48.01 180 top
LED751  [LED3MM]  170.43,48.01 180 top
LED752  [LED3MM]  175.51,48.01 180 top
LED753  [LED3MM]  180.59,48.01 180 top
LED754  [LED3MM]  185.67,48.01 180 top
LED755  [LED3MM]  190.75,48.01 180 top
LED756  [LED3MM]  195.83,48.01 180 top
LED757  [LED3MM]  200.91,48.01 180 top
LED758  [LED3MM]  205.99,48.01 180 top
LED759  [LED3MM]  211.07,48.01 180 top
LED760  [LED3MM]  216.15,48.01 180 top
LED761  [LED3MM]  18.03,42.93 180 top
LED762  [LED3MM]  23.11,42.93 180 top
LED763  [LED3MM]  28.19,42.93 180 top
LED764  [LED3MM]  33.27,42.93 180 top
LED765  [LED3MM]  38.35,42.93 180 top
LED766  [LED3MM]  43.43,42.93 180 top
LED767  [LED3MM]  48.51,42.93 180 top
LED768  [LED3MM]  53.59,42.93 180 top
LED769  [LED3MM]  58.67,42.93 180 top
LED770  [LED3MM]  63.75,42.93 180 top
LED771  [LED3MM]  68.83,42.93 180 top
LED772  [LED3MM]  73.91,42.93 180 top
LED773  [LED3MM]  78.99,42.93 180 top
LED774  [LED3MM]  84.07,42.93 180 top
LED775  [LED3MM]  89.15,42.93 180 top
LED776  [LED3MM]  94.23,42.93 180 top
LED777  [LED3MM]  99.31,42.93 180 top
LED778  [LED3MM]  104.39,42.93 180 top
LED779  [LED3MM]  109.47,42.93 180 top
LED780  [LED3MM]  114.55,42.93 180 top
LED781  [LED3MM]  119.63,42.93 180 top
LED782  [LED3MM]  124.71,42.93 180 top
LED783  [LED3MM]  129.79,42.93 180 top
LED784  [LED3MM]  134.87,42.93 180 top
LED785  [LED3MM]  139.95,42.93 180 top
LED786  [LED3MM]  145.03,42.93 180 top
LED787  [LED3MM]  150.11,42.93 180 top
LED788  [LED3MM]  155.19,42.93 180 top
LED789  [LED3MM]  160.27,42.93 180 top
LED790  [LED3MM]  165.35,42.93 180 top
LED791  [LED3MM]  170.43,42.93 180 top
LED792  [LED3MM]  175.51,42.93 180 top
LED793  [LED3MM]  180.59,42.93 180 top
LED794  [LED3MM]  185.67,42.93 180 top
LED795  [LED3MM]  190.75,42.93 180 top
LED796  [LED3MM]  195.83,42.93 180 top
LED797  [LED3MM]  200.91,42.93 180 top
LED798  [LED3MM]  205.99,42.93 180 top
LED799  [LED3MM]  211.07,42.93 180 top
LED800  [LED3MM]  216.15,42.93 180 top
LED801  [LED3MM]  18.03,37.85 180 top
LED802  [LED3MM]  23.11,37.85 180 top
LED803  [LED3MM]  28.19,37.85 180 top
LED804  [LED3MM]  33.27,37.85 180 top
LED805  [LED3MM]  38.35,37.85 180 top
LED806  [LED3MM]  43.43,37.85 180 top
LED807  [LED3MM]  48.51,37.85 180 top
LED808  [LED3MM]  53.59,37.85 180 top
LED809  [LED3MM]  58.67,37.85 180 top
LED810  [LED3MM]  63.75,37.85 180 top
LED811  [LED3MM]  68.83,37.85 180 top
LED812  [LED3MM]  73.91,37.85 180 top
LED813  [LED3MM]  78.99,37.85 180 top
LED814  [LED3MM]  84.07,37.85 180 top
LED815  [LED3MM]  89.15,37.85 180 top
LED816  [LED3MM]  94.23,37.85 180 top
LED817  [LED3MM]  99.31,37.85 180 top
LED818  [LED3MM]  104.39,37.85 180 top
LED819  [LED3MM]  109.47,37.85 180 top
LED820  [LED3MM]  114.55,37.85 180 top
LED821  [LED3MM]  119.63,37.85 180 top
LED822  [LED3MM]  124.71,37.85 180 top
LED823  [LED3MM]  129.79,37.85 180 top
LED824  [LED3MM]  134.87,37.85 180 top
LED825  [LED3MM]  139.95,37.85 180 top
LED826  [LED3MM]  145.03,37.85 180 top
LED827  [LED3MM]  150.11,37.85 180 top
LED828  [LED3MM]  155.19,37.85 180 top
LED829  [LED3MM]  160.27,37.85 180 top
LED830  [LED3MM]  165.35,37.85 180 top
LED831  [LED3MM]  170.43,37.85 180 top
LED832  [LED3MM]  175.51,37.85 180 top
LED833  [LED3MM]  180.59,37.85 180 top
LED834  [LED3MM]  185.67,37.85 180 top
LED835  [LED3MM]  190.75,37.85 180 top
LED836  [LED3MM]  195.83,37.85 180 top
LED837  [LED3MM]  200.91,37.85 180 top
LED838  [LED3MM]  205.99,37.85 180 top
LED839  [LED3MM]  211.07,37.85 180 top
LED840  [LED3MM]  216.15,37.85 180 top
LED841  [LED3MM]  18.03,32.77 180 top
LED842  [LED3MM]  23.11,32.77 180 top
LED843  [LED3MM]  28.19,32.77 180 top
LED844  [LED3MM]  33.27,32.77 180 top
LED845  [LED3MM]  38.35,32.77 180 top
LED846  [LED3MM]  43.43,32.77 180 top
LED847  [LED3MM]  48.51,32.77 180 top
LED848  [LED3MM]  53.59,32.77 180 top
LED849  [LED3MM]  58.67,32.77 180 top
LED850  [LED3MM]  63.75,32.77 180 top
LED851  [LED3MM]  68.83,32.77 180 top
LED852  [LED3MM]  73.91,32.77 180 top
LED853  [LED3MM]  78.99,32.77 180 top
LED854  [LED3MM]  84.07,32.77 180 top
LED855  [LED3MM]  89.15,32.77 180 top
LED856  [LED3MM]  94.23,32.77 180 top
LED857  [LED3MM]  99.31,32.77 180 top
LED858  [LED3MM]  104.39,32.77 180 top
LED859  [LED3MM]  109.47,32.77 180 top
LED860  [LED3MM]  114.55,32.77 180 top
LED861  [LED3MM]  119.63,32.77 180 top
LED862  [LED3MM]  124.71,32.77 180 top
LED863  [LED3MM]  129.79,32.77 180 top
LED864  [LED3MM]  134.87,32.77 180 top
LED865  [LED3MM]  139.95,32.77 180 top
LED866  [LED3MM]  145.03,32.77 180 top
LED867  [LED3MM]  150.11,32.77 180 top
LED868  [LED3MM]  155.19,32.77 180 top
LED869  [LED3MM]  160.27,32.77 180 top
LED870  [LED3MM]  165.35,32.77 180 top
LED871  [LED3MM]  170.43,32.77 180 top
LED872  [LED3MM]  175.51,32.77 180 top
LED873  [LED3MM]  180.59,32.77 180 top
LED874  [LED3MM]  185.67,32.77 180 top
LED875  [LED3MM]  190.75,32.77 180 top
LED876  [LED3MM]  195.83,32.77 180 top
LED877  [LED3MM]  200.91,32.77 180 top
LED878  [LED3MM]  205.99,32.77 180 top
LED879  [LED3MM]  211.07,32.77 180 top
LED880  [LED3MM]  216.15,32.77 180 top
LED881  [LED3MM]  18.03,27.69 180 top
LED882  [LED3MM]  23.11,27.69 180 top
LED883  [LED3MM]  28.19,27.69 180 top
LED884  [LED3MM]  33.27,27.69 180 top
LED885  [LED3MM]  38.35,27.69 180 top
LED886  [LED3MM]  43.43,27.69 180 top
LED887  [LED3MM]  48.51,27.69 180 top
LED888  [LED3MM]  53.59,27.69 180 top
LED889  [LED3MM]  58.67,27.69 180 top
LED890  [LED3MM]  63.75,27.69 180 top
LED891  [LED3MM]  68.83,27.69 180 top
LED892  [LED3MM]  73.91,27.69 180 top
LED893  [LED3MM]  78.99,27.69 180 top
LED894  [LED3MM]  84.07,27.69 180 top
LED895  [LED3MM]  89.15,27.69 180 top
LED896  [LED3MM]  94.23,27.69 180 top
LED897  [LED3MM]  99.31,27.69 180 top
LED898  [LED3MM]  104.39,27.69 180 top
LED899  [LED3MM]  109.47,27.69 180 top
LED900  [LED3MM]  114.55,27.69 180 top
LED901  [LED3MM]  119.63,27.69 180 top
LED902  [LED3MM]  124.71,27.69 180 top
LED903  [LED3MM]  129.79,27.69 180 top
LED904  [LED3MM]  134.87,27.69 180 top
LED905  [LED3MM]  139.95,27.69 180 top
LED906  [LED3MM]  145.03,27.69 180 top
LED907  [LED3MM]  150.11,27.69 180 top
LED908  [LED3MM]  155.19,27.69 180 top
LED909  [LED3MM]  160.27,27.69 180 top
LED910  [LED3MM]  165.35,27.69 180 top
LED911  [LED3MM]  170.43,27.69 180 top
LED912  [LED3MM]  175.51,27.69 180 top
LED913  [LED3MM]  180.59,27.69 180 top
LED914  [LED3MM]  185.67,27.69 180 top
LED915  [LED3MM]  190.75,27.69 180 top
LED916  [LED3MM]  195.83,27.69 180 top
LED917  [LED3MM]  200.91,27.69 180 top
LED918  [LED3MM]  205.99,27.69 180 top
LED919  [LED3MM]  211.07,27.69 180 top
LED920  [LED3MM]  216.15,27.69 180 top
LED921  [LED3MM]  18.03,22.61 180 top
LED922  [LED3MM]  23.11,22.61 180 top
LED923  [LED3MM]  28.19,22.61 180 top
LED924  [LED3MM]  33.27,22.61 180 top
LED925  [LED3MM]  38.35,22.61 180 top
LED926  [LED3MM]  43.43,22.61 180 top
LED927  [LED3MM]  48.51,22.61 180 top
LED928  [LED3MM]  53.59,22.61 180 top
LED929  [LED3MM]  58.67,22.61 180 top
LED930  [LED3MM]  63.75,22.61 180 top
LED931  [LED3MM]  68.83,22.61 180 top
LED932  [LED3MM]  73.91,22.61 180 top
LED933  [LED3MM]  78.99,22.61 180 top
LED934  [LED3MM]  84.07,22.61 180 top
LED935  [LED3MM]  89.15,22.61 180 top
LED936  [LED3MM]  94.23,22.61 180 top
LED937  [LED3MM]  99.31,22.61 180 top
LED938  [LED3MM]  104.39,22.61 180 top
LED939  [LED3MM]  109.47,22.61 180 top
LED940  [LED3MM]  114.55,22.61 180 top
LED941  [LED3MM]  119.63,22.61 180 top
LED942  [LED3MM]  124.71,22.61 180 top
LED943  [LED3MM]  129.79,22.61 180 top
LED944  [LED3MM]  134.87,22.61 180 top
LED945  [LED3MM]  139.95,22.61 180 top
LED946  [LED3MM]  145.03,22.61 180 top
LED947  [LED3MM]  150.11,22.61 180 top
LED948  [LED3MM]  155.19,22.61 180 top
LED949  [LED3MM]  160.27,22.61 180 top
LED950  [LED3MM]  165.35,22.61 180 top
LED951  [LED3MM]  170.43,22.61 180 top
LED952  [LED3MM]  175.51,22.61 180 top
LED953  [LED3MM]  180.59,22.61 180 top
LED954  [LED3MM]  185.67,22.61 180 top
LED955  [LED3MM]  190.75,22.61 180 top
LED956  [LED3MM]  195.83,22.61 180 top
LED957  [LED3MM]  200.91,22.61 180 top
LED958  [LED3MM]  205.99,22.61 180 top
LED959  [LED3MM]  211.07,22.61 180 top
LED960  [LED3MM]  216.15,22.61 180 top
Q1  [SOT23-R]  14.22,28.96 270 top
Q2  [SOT23-R]  19.3,17.27 0 bottom
Q3  [SOT23-R]  14.22,34.04 270 top
Q4  [SOT23-R]  14.22,39.12 270 top
Q5  [SOT23-R]  14.22,44.2 270 top
Q6  [SOT23-R]  14.22,49.28 270 top
Q7  [SOT23-R]  14.22,54.36 270 top
Q8  [SOT23-R]  14.22,59.44 270 top
Q9  [SOT23-R]  14.22,64.52 270 top
Q10  [SOT23-R]  14.22,69.6 270 top
Q11  [SOT23-R]  14.22,74.68 270 top
Q12  [SOT23-R]  14.22,79.76 270 top
Q13  [SOT23-R]  14.22,84.84 270 top
Q14  [SOT23-R]  14.22,89.92 270 top
Q15  [SOT23-R]  14.22,95 270 top
Q16  [SOT23-R]  14.22,100.08 270 top
Q17  [SOT23-R]  14.22,105.16 270 top
Q18  [SOT23-R]  14.22,110.24 270 top
Q19  [SOT23-R]  14.22,115.32 270 top
Q20  [SOT23-R]  14.22,120.4 270 top
Q21  [SOT23-R]  14.22,125.48 270 top
Q22  [SOT23-R]  14.22,130.56 270 top
Q23  [SOT23-R]  14.22,135.64 270 top
Q24  [SOT23-R]  13.46,139.95 0 top
Q25  BSS84  [SOT23]  20.57,4.06 90 top
Q26  [SOT23-R]  24.38,17.27 0 bottom
Q27  [SOT23-R]  29.46,17.27 0 bottom
Q28  [SOT23-R]  34.54,17.27 0 bottom
Q29  [SOT23-R]  39.62,17.27 0 bottom
Q30  [SOT23-R]  44.7,17.27 0 bottom
Q31  [SOT23-R]  49.78,17.27 0 bottom
Q32  [SOT23-R]  54.86,17.27 0 bottom
Q33  [SOT23-R]  60.2,17.27 0 bottom
Q34  [SOT23-R]  65.02,17.27 0 bottom
Q35  [SOT23-R]  70.1,17.27 0 bottom
Q36  [SOT23-R]  75.18,17.27 0 bottom
Q37  [SOT23-R]  80.26,17.27 0 bottom
Q38  [SOT23-R]  85.34,17.27 0 bottom
Q39  [SOT23-R]  90.42,17.27 0 bottom
Q40  [SOT23-R]  95.5,17.27 0 bottom
Q41  [SOT23-R]  100.58,17.27 0 bottom
Q42  [SOT23-R]  105.66,17.27 0 bottom
Q43  [SOT23-R]  110.74,17.27 0 bottom
Q44  [SOT23-R]  115.82,17.27 0 bottom
Q45  [SOT23-R]  120.9,17.27 0 bottom
Q46  [SOT23-R]  125.98,17.27 0 bottom
Q47  [SOT23-R]  131.06,17.27 0 bottom
Q48  [SOT23-R]  136.14,17.27 0 bottom
Q49  [SOT23-R]  141.22,17.27 0 bottom
Q50  [SOT23-R]  146.3,17.27 0 bottom
Q51  [SOT23-R]  151.38,17.27 0 bottom
Q52  [SOT23-R]  156.46,17.27 0 bottom
Q53  [SOT23-R]  161.54,17.27 0 bottom
Q54  [SOT23-R]  166.62,17.27 0 bottom
Q55  [SOT23-R]  171.7,17.27 0 bottom
Q56  [SOT23-R]  176.78,17.27 0 bottom
Q57  [SOT23-R]  181.86,17.27 0 bottom
Q58  [SOT23-R]  186.94,17.27 0 bottom
Q59  [SOT23-R]  192.02,17.27 0 bottom
Q60  [SOT23-R]  197.1,17.27 0 bottom
Q61  [SOT23-R]  202.18,17.27 0 bottom
Q62  [SOT23-R]  207.26,17.27 0 bottom
Q63  [SOT23-R]  212.34,17.27 0 bottom
Q64  [SOT23-R]  216.66,16.26 90 bottom
Q65  [SOT23-R]  14.22,23.88 270 top
R1  150  [0805]  16.76,20.07 90 bottom
R2  150  [0805]  21.84,20.07 90 bottom
R3  150  [0805]  26.92,20.07 90 bottom
R4  150  [0805]  32,20.07 90 bottom
R5  150  [0805]  37.08,20.07 90 bottom
R6  150  [0805]  42.16,20.07 90 bottom
R7  150  [0805]  47.24,20.07 90 bottom
R8  150  [0805]  52.32,20.07 90 bottom
R9  150  [0805]  57.4,20.07 90 bottom
R10  150  [0805]  62.48,20.07 90 bottom
R11  150  [0805]  67.56,20.07 90 bottom
R12  150  [0805]  72.64,20.07 90 bottom
R13  150  [0805]  77.72,20.07 90 bottom
R14  150  [0805]  82.8,20.07 90 bottom
R15  150  [0805]  87.88,20.07 90 bottom
R16  150  [0805]  92.96,20.07 90 bottom
R17  150  [0805]  98.04,20.07 90 bottom
R18  150  [0805]  103.12,20.07 90 bottom
R19  150  [0805]  108.2,20.07 90 bottom
R20  150  [0805]  113.28,20.07 90 bottom
R21  150  [0805]  118.36,20.07 90 bottom
R22  150  [0805]  123.44,20.07 90 bottom
R23  150  [0805]  128.52,20.07 90 bottom
R24  150  [0805]  133.6,20.07 90 bottom
R25  150  [0805]  138.68,20.07 90 bottom
R26  150  [0805]  143.76,20.07 90 bottom
R27  150  [0805]  148.84,20.07 90 bottom
R28  150  [0805]  153.92,20.07 90 bottom
R29  150  [0805]  159,20.07 90 bottom
R30  150  [0805]  164.08,20.07 90 bottom
R31  150  [0805]  169.16,20.07 90 bottom
R32  150  [0805]  174.24,20.07 90 bottom
R33  150  [0805]  179.32,20.07 90 bottom
R34  150  [0805]  184.4,20.07 90 bottom
R35  150  [0805]  189.48,20.07 90 bottom
R36  150  [0805]  194.56,20.07 90 bottom
R37  150  [0805]  199.64,20.07 90 bottom
R38  150  [0805]  204.72,20.07 90 bottom
R39  150  [0805]  209.8,20.07 90 bottom
R40  150  [0805]  214.88,20.32 90 bottom
R41  33R  [0805]  14.48,10.67 270 top
R42  33R  [0805]  12.45,10.67 270 top
R43  1k  [0805]  13.21,2.03 180 top
R44  10k  [0805]  18.03,6.86 90 top
R45  22k  [0805]  10.16,8.38 270 top
R46  1k  [0805]  13.21,4.06 0 top
RST  SWITCH_MCTAEF  [SWITCH_MCTAEF]  5.08,29.72 90 top
SW3  SWITCH_MCTAEF  [SWITCH_MCTAEF]  194.06,3.05 0 top
SW4  SWITCH_MCTAEF  [SWITCH_MCTAEF]  186.94,9.4 0 top
SW5  SWITCH_MCTAEF  [SWITCH_MCTAEF]  201.42,9.14 0 top
SW6  SWITCH_MCTAEF  [SWITCH_MCTAEF]  194.06,15.49 0 top
U1  [LQFP48]  31.5,9.65 0 top
X1  MINI-USB-32005-201  [32005-201]  5.33,20.32 0 top
X2  HEBW 21  [733980-62]  0.25,136.65 270 top

## Tracks (layer width: path | path; a pad name or v marks a point on that pad's centre or on a via)
+3V3  (via drill 0.4)
  Top 0.254: U1.8 25.27,8.9 C5.1 | C6.1 30.75,15.37 U1.44 30.75,13.22 30.73,13.21 30.73,12.45 v30.23,11.94
  Top 0.406: C2.1 19.94,19.81 IC10.1 | IC10.1 IC10.2 | C4.1 21.2,17.33 | 21.2,17.33 C3.1 21.2,15.49 26.92,15.49 v26.92,13.97 | IC10.1 21.2,17.33 | R43.1 16,2.03 16.26,2.29 20.42,2.29 20.57,2.44 20.57,4.83 20.76,5.01 Q25.2 | Q25.2 23.11,3.56 23.11,3.05 24.21,1.95 25.06,1.95 25.91,2.79 25.91,7.5 C5.1 | v19.81,5.84 20.85,5.84 Q25.2
  Bottom 0.254: v26.92,13.97 27.69,13.97 v30.23,11.94
  Bottom 0.406: v26.92,13.97 26.92,12.95 v19.81,5.84
+5V  (via drill 0.4)
  Top 0.406: IC10.8 20.46,11.61 C1.1 20.46,9.03 19.19,7.76 R44.2 | R44.2 17.53,7.76 | v5.08,9.4 0.76,9.4 0.76,2.29 2.54,0.51 44.45,0.51 | 44.45,0.51 v46.99,3.05 | v55.63,1.52 54.61,0.51 | 54.61,0.51 44.45,0.51 | v67.31,1.52 66.29,0.51 | 66.29,0.51 54.61,0.51 | v154.43,1.52 153.42,0.51 | 153.42,0.51 145.54,0.51 | 145.54,0.51 66.29,0.51 | v166.37,1.52 165.35,0.51 | 165.35,0.51 153.42,0.51 | v177.8,1.52 176.78,0.51 165.35,0.51 | v145.54,2.54 145.54,0.51 | v7.11,33.78 7.11,29.21 | R44.2 16.39,9.4 v16,9.4 16.13,9.4 IC10.5 13.22,15.04 13.22,21.84 11.68,21.84 12.12,21.92
  Top 0.61: X1.1 12.12,21.92
  Top 0.813: 11.68,21.84 11.68,26.67 7.11,26.67 7.11,29.21 JP2.1
  Bottom 0.254: IC2.10 6.73,76.83 8.13,78.23 8.13,82.3 | 8.13,84.33 3.91,84.33 IC2.16
  Bottom 0.406: v16,9.4 v5.08,9.4 | v46.99,3.05 47.9,3.05 IC4.16 | v55.63,1.52 55.75,1.65 IC4.10 55.63,3.15 v55.63,1.52 | IC5.10 67.44,1.65 v67.31,1.52 | v55.63,1.52 59.69,1.52 59.82,1.65 IC5.16 | IC6.10 154.56,1.65 v154.43,1.52 156.72,1.52 158.47,3.28 IC7.16 | v166.37,1.52 166.24,1.65 IC7.10 166.37,3.15 v166.37,1.52 | IC8.10 177.93,1.65 v177.8,1.52 | v166.37,1.52 168.55,1.52 IC8.16 | v145.54,2.54 146.28,3.28 IC6.16 | IC1.16 5.71,125.09 6.1,124.71 6.1,123.95 7.11,122.94 7.11,117.35 | 7.11,117.35 3.91,117.35 IC1.10 | 7.11,36.32 3.91,36.32 IC3.10 | 7.11,36.32 8.13,36.32 8.13,43.94 | 7.11,36.32 v7.11,33.78 | 8.13,43.94 8,44.07 IC3.16 | 8.13,43.94 8.13,82.3 8.13,84.33 7.11,84.33 7.11,117.35
D+
  Top 0.406: X1.3 11.18,20.32 11.68,19.81 11.68,14.48 12.45,13.72 R42.1 12.33,11.57 11.43,10.67 11.43,8.38 8.64,8.38 8.64,7.11 9.65,6.1 10.28,6.1 R46.1
D-
  Top 0.406: X1.2 8.37,21.08 11.43,21.08 12.45,20.07 12.45,14.73 14.48,12.7 R41.1
DATA  (via drill 0.4)
  Top 0.254: v34.29,8.38 34.31,8.4 U1.28 41.38,8.4 44.7,5.08 v50.55,5.08
  Bottom 0.254: v34.29,8.38 34.29,7.62 35.56,6.35 35.56,0.51 1.27,0.51 1.27,121.67 2.16,122.56 IC1.14 | v50.55,5.08 50.67,4.83 IC4.14
GND  (via drill 0.4)
  Top 0.254: 32.26,15.49 32.25,15.48 U1.41 | C5.2 24.89,6.6 24.13,5.84 v23.62,5.84 | v28.7,10.16 28.44,10.4 U1.5
  Top 0.406: 18.66,12.12 IC10.7 18.67,13.72 | 18.66,12.12 C1.2 | 21.34,13.72 C8.1 23,13.72 | 21.34,13.72 18.67,13.72 | 18.66,12.12 17.4,12.12 IC10.6 | C5.2 23.37,6.72 C7.1 21.34,7.23 21.34,13.72 | 18.67,13.72 17.4,13.72 17.4,15.75 | 17.4,15.75 IC10.3 | C6.2 32.26,17.27 32.26,15.49 | C3.2 22.1,16.51 22.1,20.83 15.24,20.83 15.24,15.75 17.4,15.75
  Bottom 0.254: v23.62,5.84 26.67,5.84 28.7,7.87 v28.7,10.16